# EAGLE schematic umodular_mega_shield_rev02 (EAGLE 7.2.0)
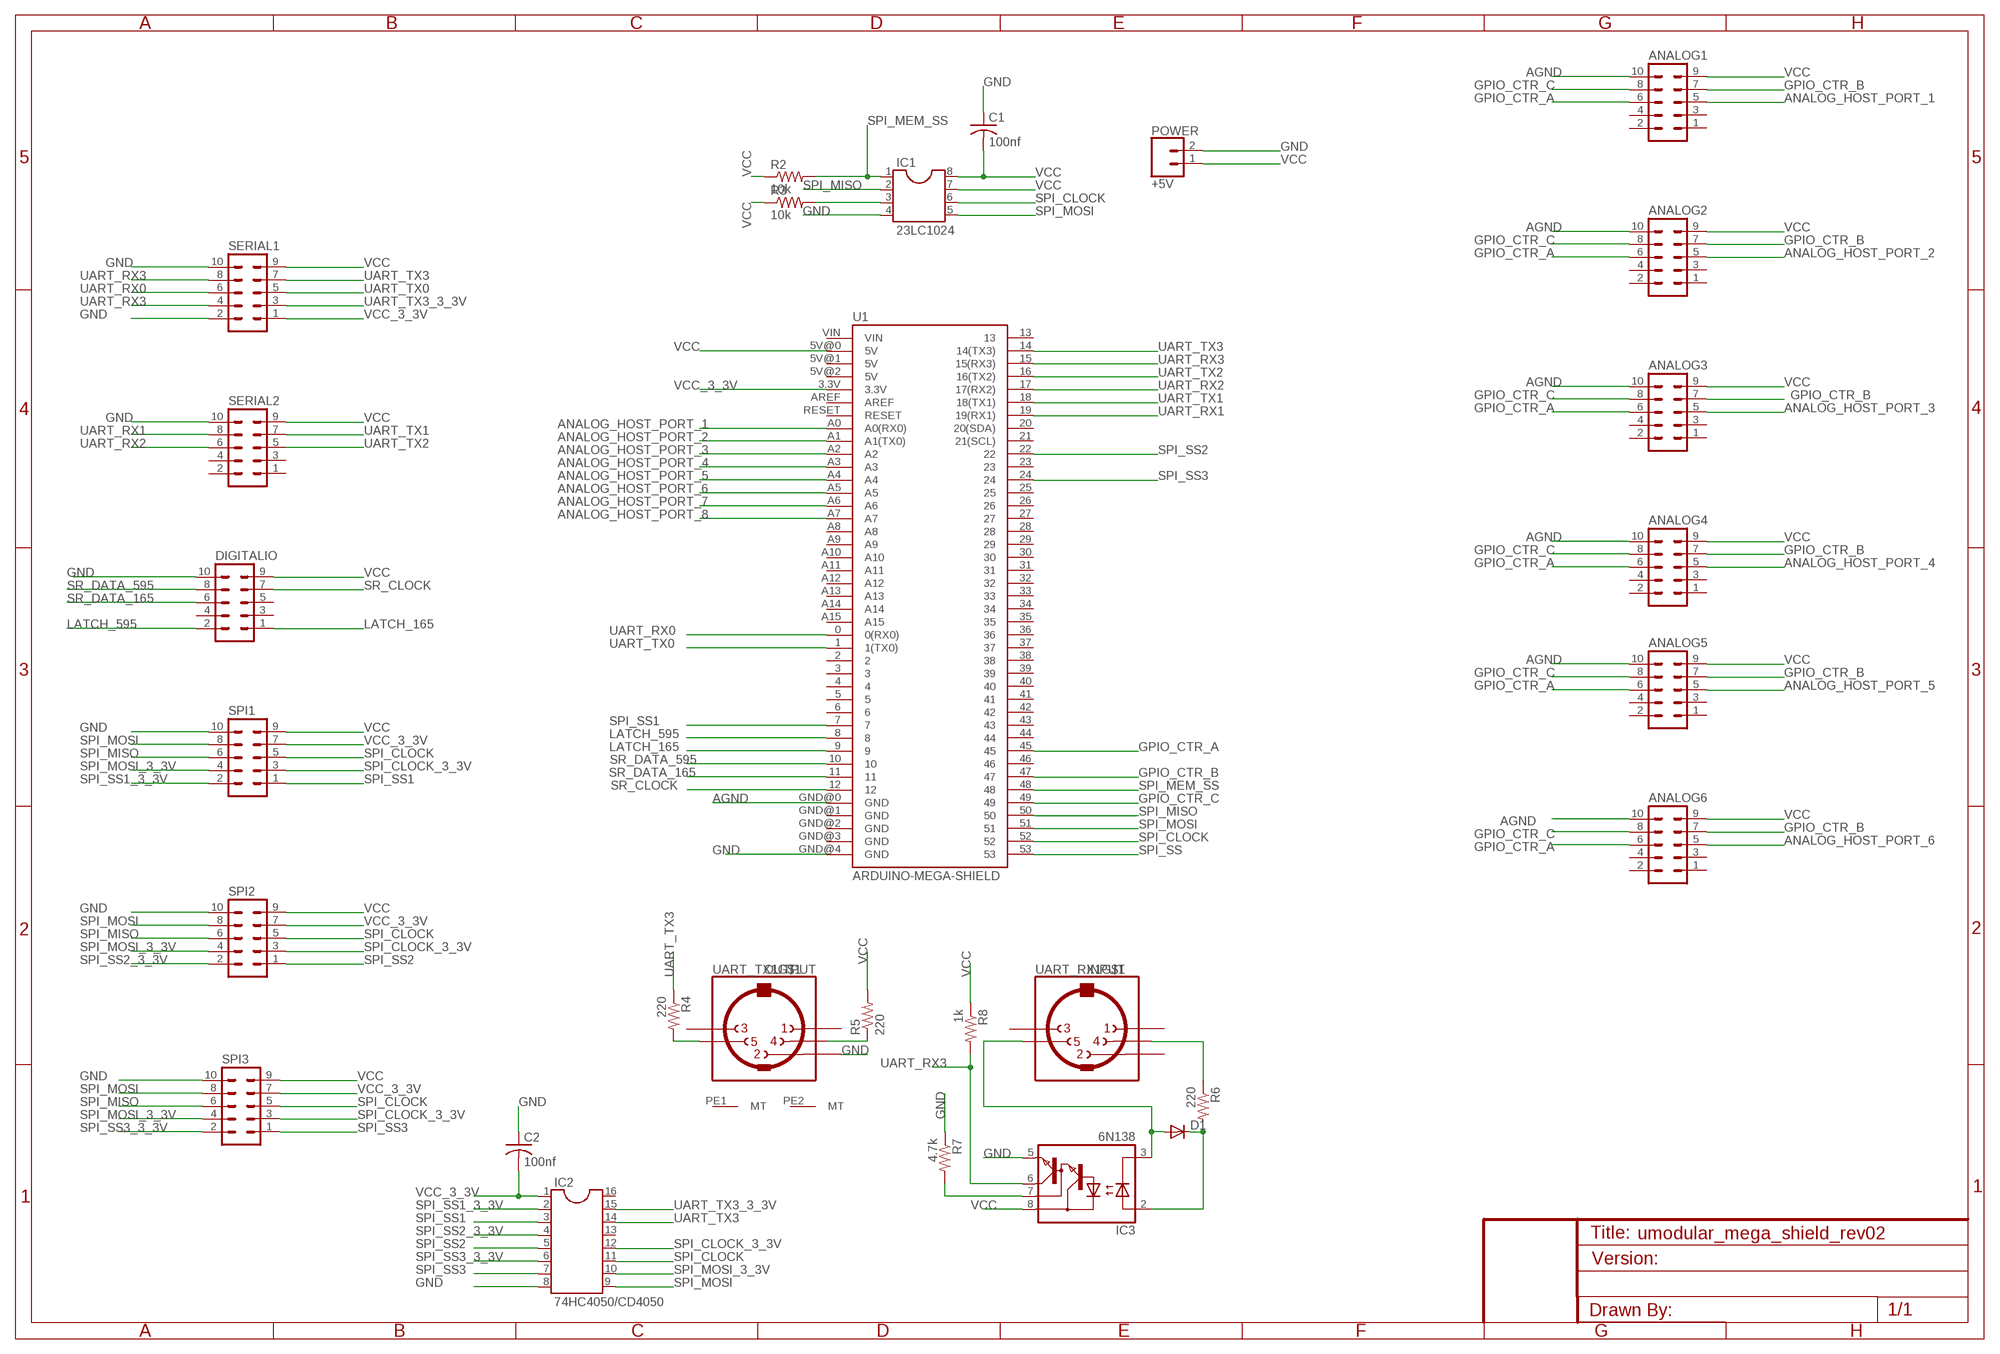
[diagram p0: schematic, sheet 1]

## Parts
ANALOG1  MA05-2  [MA05-2]
ANALOG2  MA05-2  [MA05-2]
ANALOG3  MA05-2  [MA05-2]
ANALOG4  MA05-2  [MA05-2]
ANALOG5  MA05-2  [MA05-2]
ANALOG6  MA05-2  [MA05-2]
C1  100nf  C-US050-024X044  [C050-024X044]
C2  100nf  C-US050-024X044  [C050-024X044]
D1  1N4148DO35-7  [DO35-7]
DIGITALIO  MA05-2  [MA05-2]
IC1  23LC1024  DIL8  [DIL08]
IC2  74HC4050/CD4050  DIL16  [DIL16]
IC3  6N138  [DIL08]
POWER  +5V  CONN_02LOCK_LONGPADS  [1X02_LOCK_LONGPADS]
R2  10k  R-US_0204/7  [0204/7@1]
R3  10k  R-US_0204/7  [0204/7@1]
R4  220  R-US_0204/7  [0204/7@1]
R5  220  R-US_0204/7  [0204/7@1]
R6  220  R-US_0204/7  [0204/7@1]
R7  4.7k  R-US_0204/7  [0204/7@1]
R8  1k  R-US_0204/7  [0204/7@1]
SERIAL1  MA05-2  [MA05-2]
SERIAL2  MA05-2  [MA05-2]
SPI1  MA05-2  [MA05-2]
SPI2  MA05-2  [MA05-2]
SPI3  MA05-2  [MA05-2]
U1  ARDUINO-MEGA-SHIELD  ARDUINO-MEGAFULL  [ARDUINO_MEGA@1]
UART_RX1  INPUT  MIDIJACK  [CP-2350]
UART_TX1  OUTPUT  MIDIJACK  [CP-2350]

## Nets
AGND: ANALOG1.10 ANALOG2.10 ANALOG3.10 ANALOG4.10 ANALOG5.10 ANALOG6.10 U1.GND@0(GND)
ANALOG_HOST_PORT_1: ANALOG1.5 U1.A0(A0(RX0))
ANALOG_HOST_PORT_2: ANALOG2.5 U1.A1(A1(TX0))
ANALOG_HOST_PORT_3: ANALOG3.5 U1.A2
ANALOG_HOST_PORT_4: ANALOG4.5 U1.A3
ANALOG_HOST_PORT_5: ANALOG5.5 U1.A4
ANALOG_HOST_PORT_6: ANALOG6.5 U1.A5
ANALOG_HOST_PORT_7: U1.A6
ANALOG_HOST_PORT_8: U1.A7
GND: C1.1 C2.1 DIGITALIO.10 IC1.4 IC2.8 IC3.5(GND) POWER.2 R7.1 SERIAL1.2 SERIAL1.10 SERIAL2.10 SPI1.10 SPI2.10 SPI3.10 U1.GND@4(GND) UART_TX1.2
GPIO_CTR_A: ANALOG1.6 ANALOG2.6 ANALOG3.6 ANALOG4.6 ANALOG5.6 ANALOG6.6 U1.45
GPIO_CTR_B: ANALOG1.7 ANALOG2.7 ANALOG3.7 ANALOG4.7 ANALOG5.7 ANALOG6.7 U1.47
GPIO_CTR_C: ANALOG1.8 ANALOG2.8 ANALOG3.8 ANALOG4.8 ANALOG5.8 ANALOG6.8 U1.49
LATCH_165: DIGITALIO.1 U1.9
LATCH_595: DIGITALIO.2 U1.8
N$2: R5.1 UART_TX1.4
N$3: R4.2 UART_TX1.5
N$4: IC1.3 R3.2
N$5: R6.1 UART_RX1.4
N$6: D1.C IC3.2(A) R6.2
N$7: D1.A IC3.3(C) UART_RX1.5
N$8: IC3.7(VB) R7.2
SPI_CLOCK: IC1.6 IC2.11 SPI1.5 SPI2.5 SPI3.5 U1.52
SPI_CLOCK_3_3V: IC2.12 SPI1.3 SPI2.3 SPI3.3
SPI_MEM_SS: IC1.1 R2.2 U1.48
SPI_MISO: IC1.2 SPI1.6 SPI2.6 SPI3.6 U1.50
SPI_MOSI: IC1.5 IC2.9 SPI1.8 SPI2.8 SPI3.8 U1.51
SPI_MOSI_3_3V: IC2.10 SPI1.4 SPI2.4 SPI3.4
SPI_SS: U1.53
SPI_SS1: IC2.3 SPI1.1 U1.7
SPI_SS1_3_3V: IC2.2 SPI1.2
SPI_SS2: IC2.5 SPI2.1 U1.22
SPI_SS2_3_3V: IC2.4 SPI2.2
SPI_SS3: IC2.7 SPI3.1 U1.24
SPI_SS3_3_3V: IC2.6 SPI3.2
SR_CLOCK: DIGITALIO.7 U1.12
SR_DATA_165: DIGITALIO.6 U1.11
SR_DATA_595: DIGITALIO.8 U1.10
UART_RX0: SERIAL1.6 U1.0(0(RX0))
UART_RX1: SERIAL2.8 U1.19(19(RX1))
UART_RX2: SERIAL2.6 U1.17(17(RX2))
UART_RX3: IC3.6(VO) R8.2 SERIAL1.4 SERIAL1.8 U1.15(15(RX3))
UART_TX0: SERIAL1.5 U1.1(1(TX0))
UART_TX1: SERIAL2.7 U1.18(18(TX1))
UART_TX2: SERIAL2.5 U1.16(16(TX2))
UART_TX3: IC2.14 R4.1 SERIAL1.7 U1.14(14(TX3))
UART_TX3_3_3V: IC2.15 SERIAL1.3
VCC: ANALOG1.9 ANALOG2.9 ANALOG3.9 ANALOG4.9 ANALOG5.9 ANALOG6.9 C1.2 DIGITALIO.9 IC1.7 IC1.8 IC3.8(VCC) POWER.1 R2.1 R3.1 R5.2 R8.1 SERIAL1.9 SERIAL2.9 SPI1.9 SPI2.9 SPI3.9 U1.5V@0(5V)
VCC_3_3V: C2.2 IC2.1 SERIAL1.1 SPI1.7 SPI2.7 SPI3.7 U1.3.3V
Unconnected: ANALOG1.1 ANALOG1.2 ANALOG1.3 ANALOG1.4 ANALOG2.1 ANALOG2.2 ANALOG2.3 ANALOG2.4 ANALOG3.1 ANALOG3.2 ANALOG3.3 ANALOG3.4 ANALOG4.1 ANALOG4.2 ANALOG4.3 ANALOG4.4 ANALOG5.1 ANALOG5.2 ANALOG5.3 ANALOG5.4 ANALOG6.1 ANALOG6.2 ANALOG6.3 ANALOG6.4 DIGITALIO.3 DIGITALIO.4 DIGITALIO.5 IC2.13 IC2.16 SERIAL2.1 SERIAL2.2 SERIAL2.3 SERIAL2.4 U1.2 U1.3 U1.4 U1.5 U1.5V@1(5V) U1.5V@2(5V) U1.6 U1.13 U1.20(20(SDA)) U1.21(21(SCL)) U1.23 U1.25 U1.26 U1.27 U1.28 U1.29 U1.30 U1.31 U1.32 U1.33 U1.34 U1.35 U1.36 U1.37 U1.38 U1.39 U1.40 U1.41 U1.42 U1.43 U1.44 U1.46 U1.A8 U1.A9 U1.A10 U1.A11 U1.A12 U1.A13 U1.A14 U1.A15 U1.AREF U1.GND@1(GND) U1.GND@2(GND) U1.GND@3(GND) U1.RESET U1.VIN UART_RX1.1 UART_RX1.2 UART_RX1.3 UART_RX1.PE1(MT) UART_RX1.PE2(MT) UART_RX1.PE(MT) UART_RX1.PE@(MT) UART_TX1.1 UART_TX1.3 UART_TX1.PE1(MT) UART_TX1.PE2(MT) UART_TX1.PE(MT) UART_TX1.PE@(MT)

## Library data of the parts
ANALOG1-ANALOG6 DIGITALIO SERIAL1 SERIAL2 SPI1-SPI3 = con-lstb:MA05-2: PIN HEADER; OC_FARNELL: unknown; OC_NEWARK: unknown
C1 C2 = rcl:C-US: CAPACITOR, American symbol
D1 = diode:1N4148: DIODE high speed (Philips)
IC1 = ic-package:DIL8: Dual In Line / Socket
IC2 = ic-package:DIL16: Dual In Line / Socket
IC3 = optocoupler:6N138: MOTOROLA OPTO COUPLER; MF: VISHAY/TELEFUNKEN; MPN: 6N138; OC_FARNELL: 9860150; OC_NEWARK: 35K5294
POWER = SparkFun-Connectors:CONN_02: Multi connection point. Often used as Generic Header-pin footprint for 0.1 inch spaced/style header connections On any of the 0.1 inch spaced packages, you can populate with these: Break Away Headers - Straight <https://www.sparkfun.com/products/116> (PRT-00116) Break Away Male Headers - Right Angle <https://www.sparkfun.com/products/553> (PRT-00553) Female Headers <https://www.sparkfun.com/products/115> (PRT-00115) Break Away Headers - Machine Pin <https://www.sparkfun.com/products/117> (PRT-00117) Break Away Female Headers - Swiss Machine Pin <https://www.sparkfun.com/products/743> (PRT-00743) For SCREWTERMINALS and SPRING TERMINALS visit here: Screw Terimnals on SparkFun.com <https://www.sparkfun.com/search/results?term=Screw+Terminals> (5mm/3.5mm/2.54mm spacing) This device is also useful as a general connection point to wire up your design to another part of your project. Our various solder wires solder well into these plated through hole pads. Hook-Up Wire - Assortment (Stranded, 22 AWG) <https://www.sparkfun.com/products/11375> (PRT-11375) Hook-Up Wire - Assortment (Solid Core, 22 AWG) <https://www.sparkfun.com/products/11367> (PRT-11367) View the entire wire category on our website here <https://www.sparkfun.com/categories/141> Special notes: Molex polarized connector foot print use with: PRT-08233 with associated crimp pins and housings. 2.54_SCREWTERM for use with PRT-10571. 3.5mm Screw Terminal footprints for PRT-08084 5mm Screw Terminal footprints for use with PRT-08432
R2-R8 = rcl:R-US_: RESISTOR, American symbol
U1 = SparkFun-Boards:ARDUINO-MEGA: Arduino Mega board footprint
UART_RX1 UART_TX1 = adafruit:MIDIJACK: DIN 5 jack also known as MIDI jack A modification of conn-hirshman:MAB5SH with two options for the grounding 'teeth'

## Net classes
0 default: width 0.305 mm